# Altium schematic sheet SCB_XTR.SchDoc
size A4
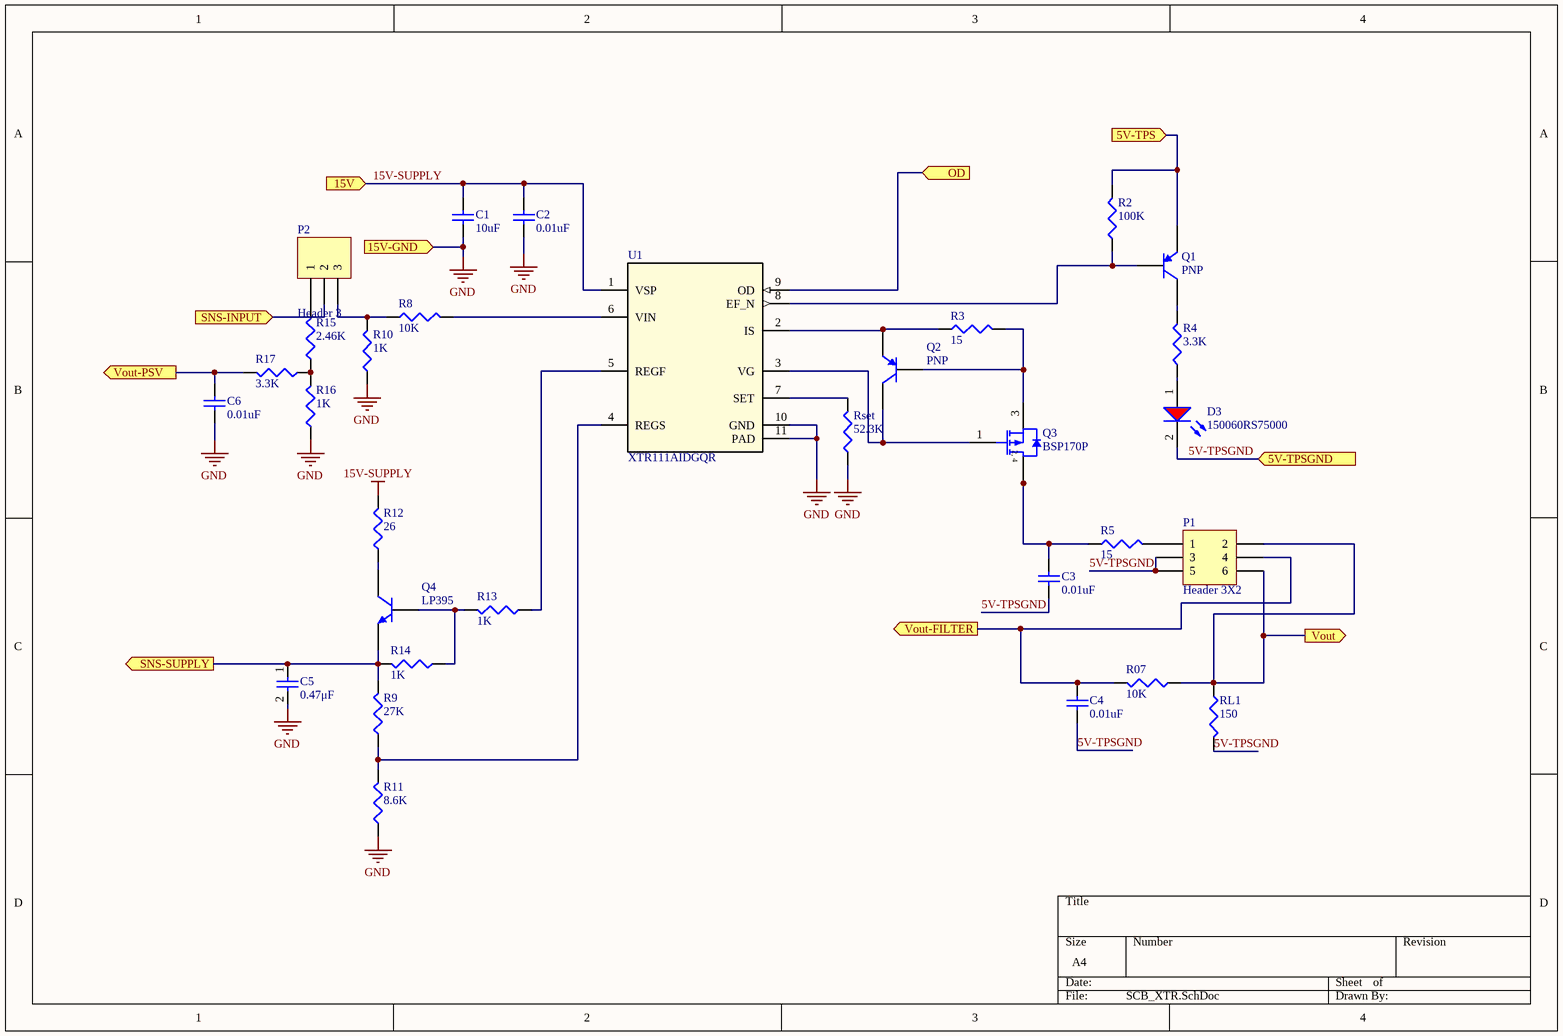
[diagram p0: SCB_XTR.SchDoc]

## Parts
C1  10uF  [RAD-0.3]
C2  0.01uF  [1608[0603]]
C3  0.01uF  [1608[0603]]
C4  0.01uF  [1608[0603]]
C5  0.47μF  [WCAP-CSGP 0805, H=1.25mm]
C6  0.01uF  [1608[0603]]
D3  150060RS75000  [LED_0603_Red]
P1  Header 3X2  [HDR2X3]
P2  Header 3  [HDR1X3]
Q1  PNP  [SOT-23B_N]
Q2  PNP  [SOT-23B_N]
Q3  BSP170P  [INF-PG-SOT223_SC-73_M]
Q4  LP395  [TO-92A]
R2  100K  [J1-0603]
R3  15  [J1-0603]
R4  3.3K  [J1-0603]
R5  15  [J1-0603]
R07  10K  [J1-0603]
R8  10K  [J1-0603]
R9  27K  [J1-0603]
R10  1K  [J1-0603]
R11  8.6K  [J1-0603]
R12  26  [J1-0603]
R13  1K  [J1-0603]
R14  1K  [J1-0603]
R15  2.46K  [J1-0603]
R16  1K  [J1-0603]
R17  3.3K  [J1-0603]
RL1  150  [J1-0603]
Rset  52.3K  [RESC2012M]
U1  XTR111AIDGQR  [DGQ0010D_NV_N]

## Ports
5V-TPS (in), 5V-TPSGND (in), 15V (in), 15V-GND (in), OD (in), SNS-INPUT (in), SNS-SUPPLY (out), Vout (out), Vout-FILTER (out), Vout-PSV (out)

## Nets
15V-SUPPLY: C1.2 C2.2 R12.2 U1.1(VSP) ; port 15V
GND: C1.1 C2.1 C5.2 C6.1 R10.1 R11.1 R16.1 Rset.1 U1.10(GND) U1.11(PAD) ; port 15V-GND
5V-TPS: Q1.3(E) R2.2 ; port 5V-TPS
5V-TPSGND: C3.1 C4.1 D3.2(C) P1.3 P1.5 RL1.2 ; port 5V-TPSGND
OD: U1.9(OD) ; port OD
SNS-INPUT: P2.2 ; port SNS-INPUT
SNS-SUPPLY: C5.1 Q4.1(E) R9.2 R14.2 ; port SNS-SUPPLY
Vout: P1.2 P1.6 R07.1 RL1.1 ; port Vout
Vout-FILTER: C4.2 P1.4 R07.2 ; port Vout-FILTER
Vout-PSV: C6.2 R17.2 ; port Vout-PSV
NetC3_2: C3.2 Q3.2(DRAIN) Q3.4(DRAIN) R5.1
NetD3_1: D3.1(A) R4.1
NetP1_1: P1.1 R5.2
NetP2_1: P2.1 R15.2
NetP2_3: P2.3 R8.1 R10.2
NetQ1_1: Q1.1(C) R4.2
NetQ1_2: Q1.2(B) R2.1 U1.8(EF_N)
NetQ2_1: Q2.1(C) Q3.1(GATE) U1.3(VG)
NetQ2_2: Q2.2(B) Q3.3(SOURCE) R3.2
NetQ2_3: Q2.3(E) R3.1 U1.2(IS)
NetQ4_2: Q4.2(B) R13.2 R14.1
NetQ4_3: Q4.3(C) R12.1
NetR8_2: R8.2 U1.6(VIN)
NetR9_1: R9.1 R11.2 U1.4(REGS)
NetR13_1: R13.1 U1.5(REGF)
NetR15_1: R15.1 R16.2 R17.1
NetRset_2: Rset.2 U1.7(SET)

## Notes on the sheet
- (in symbol BSP170P) 2, 4

## Library data of the parts
C1 = Cap: Capacitor; Published: 8-Jun-2000; LatestRevisionDate: 17-Jul-2002; LatestRevisionNote: Re-released for DXP Platform.; PackageReference: RAD-0.3; Publisher: Altium Limited; PackageDescription: Radial Cap, Thru-Hole; 2 Leads; 0.3 in Pin Spacing; Value: 10uF
C2-C4 C6 = Cap Semi: Capacitor (Semiconductor SIM Model); Published: 8-Jun-2000; LatestRevisionDate: 29-May-2009; LatestRevisionNote: IPC-7351 Footprint Added.; PackageReference: C1206; Publisher: Altium Limited; PackageDescription: Chip Capacitor; Value: 0.01uF
C5 = WCAP-CSGP 0805, 885012207026: CAP CER 1UF 50V 10% X5R 0805; Manufacturer: TDK; partNo: CGA4J3X5R1H105K125AB; ComponentLink1Description: TDK; ComponentLink1URL: http://www.TDK.com; Created by: Saurabh; Created Date: 3/9/2015; Capacitance: 0.47μF
D3 = WL-SMCW 0603  150060RS75000: SMD mono-color Chip LED, WL-SMCW, Red; Manufacturer: W黵th Elektronik eiSos GmbH; PartNo: 150060RS75000; ComponentLink1Description: Manufacturer; ComponentLink1URL: http://www.we-online.de; Created by: Christin Otto; Created Date: June 2013; ComponentLink2Description: Datasheet; ComponentLink2URL: http://katalog.we-online.com/led/datasheet/150060RS75000.pdf; Color: Red
P1 = Header 3X2: Header, 3-Pin, Dual row; LatestRevisionDate: 17-Jul-2002; LatestRevisionNote: Re-released for DXP Platform.; Publisher: Altium Limited
P2 = Header 3: Header, 3-Pin; LatestRevisionDate: 17-Jul-2002; LatestRevisionNote: Re-released for DXP Platform.; Publisher: Altium Limited
Q1 Q2 = PNP: PNP Bipolar Transistor; Published: 8-Jun-2000; LatestRevisionDate: 29-May-2009; LatestRevisionNote: IPC-7351 Footprint Added.; PackageVersion: Aug-1999; PackageReference: SOT-23B; Publisher: Altium Limited; PackageDescription: 3-Pin SOT-23 Package 0.95 mm Pitch, 2.4 mm Lead Span
Q3 = BSP170P: P-Channel SIPMOS Small-Signal-Transistor, -60 V VDS, -1.9 A ID, -55 to 150 degC, PG-SOT223 (SC-73), Reel, Green; Manufacturer: Infineon; Green: TRUE; ID (max): -1.9 A; IDpuls (max): -7.6 A; Mode: Enhancement; Polarity: P; Pto t (max): 1.8 mW; QG: -12.5 nC; RDS (on) (max): 300 mOhm; Rth: 110 K/W; VDS (max): -60 V; VGS(th) (max): -4 V; VGS(th) (min): -2.1 V; DatasheetVersion: Rev. 2.53; PackageVersion: Apr-08; PackageReference: PG-SOT223 (SC-73); PackageDescription: 4-Pin Small Outline Transistor Package, 6.5 x 3.5 mm Body, 2.3 mm Pitch; Halogen-free: TRUE; Packing: Reel; Technology: SIPMOS; Mounting Technology: Surface Mount; PartNumber: BSP170P; ComponentLink1Description: Manufacturer URL; ComponentLink1URL: http://www.infineon.com/; ComponentLink2Description: Datasheet; ComponentLink2URL: http://www.infineon.com/dgdl/BSP170P_Rev2.53.pdf?folderId=db3a304314dca38901154a72e3951a65&fileId=db3a30433b47825b013b5fdad470576f; ComponentLink3Description: Package Specification; ComponentLink3URL: http://www.infineon.com/dgdl/SOT223-Package_Overview.pdf?folderId=db3a30431936bc4b0119530470b03c3d&fileId=db3a30431936bc4b0119531d40b93c5c
Q4 = 2N3904: NPN General Purpose Amplifier; Published: 8-Jun-2000; LatestRevisionDate: 15-Jan-2003; LatestRevisionNote: PCB Footprint 'BCY-W3/D4.7' replaced; DatasheetVersion: 1997; PackageVersion: Sep-1998; PackageReference: TO-92A; Publisher: Altium Limited; PackageDescription: TO, Flat Index; 3 In-Line, Axial Leads; Body Dia. 4.5mm; Leads 0.51 x 0.48 mm (max); ComponentLink1Description: Manufacturer Link; ComponentLink1URL: http://www.fairchildsemi.com/; ComponentLink2Description: Datasheet; ComponentLink2URL: http://www.fairchildsemi.com/ds/2N%2F2N3904.pdf
R2-R5 R07-R17 RL1 Rset = Res3: Resistor; Published: 8-Jun-2000; LatestRevisionDate: 29-May-2009; LatestRevisionNote: IPC-7351 Footprint Added.; PackageReference: J1-0603; Publisher: Altium Limited; PackageDescription: Chip Resistor
  R2: Value: 100K
  R3 R5: Value: 15
  R4 R17: Value: 3.3K
  R07 R8: Value: 10K
  R9: Value: 27K
  R10 R13 R14 R16: Value: 1K
  R11: Value: 8.6K
  R12: Value: 26
  R15: Value: 2.46K
  RL1: Value: 150
  Rset: Value: 52.3K
U1 = XTR111AIDGQR: Imported; PartNumber: XTR111AIDGQT; Manufacturer: Texas Instruments; CompType: IC; PIN_COUNT: 11; Application_BuildNumber: *; PackageReference: DGQ0010D; MountType: SMT; RoHS: Y; RefDes: RefDes; Type: DEV; Value: Value